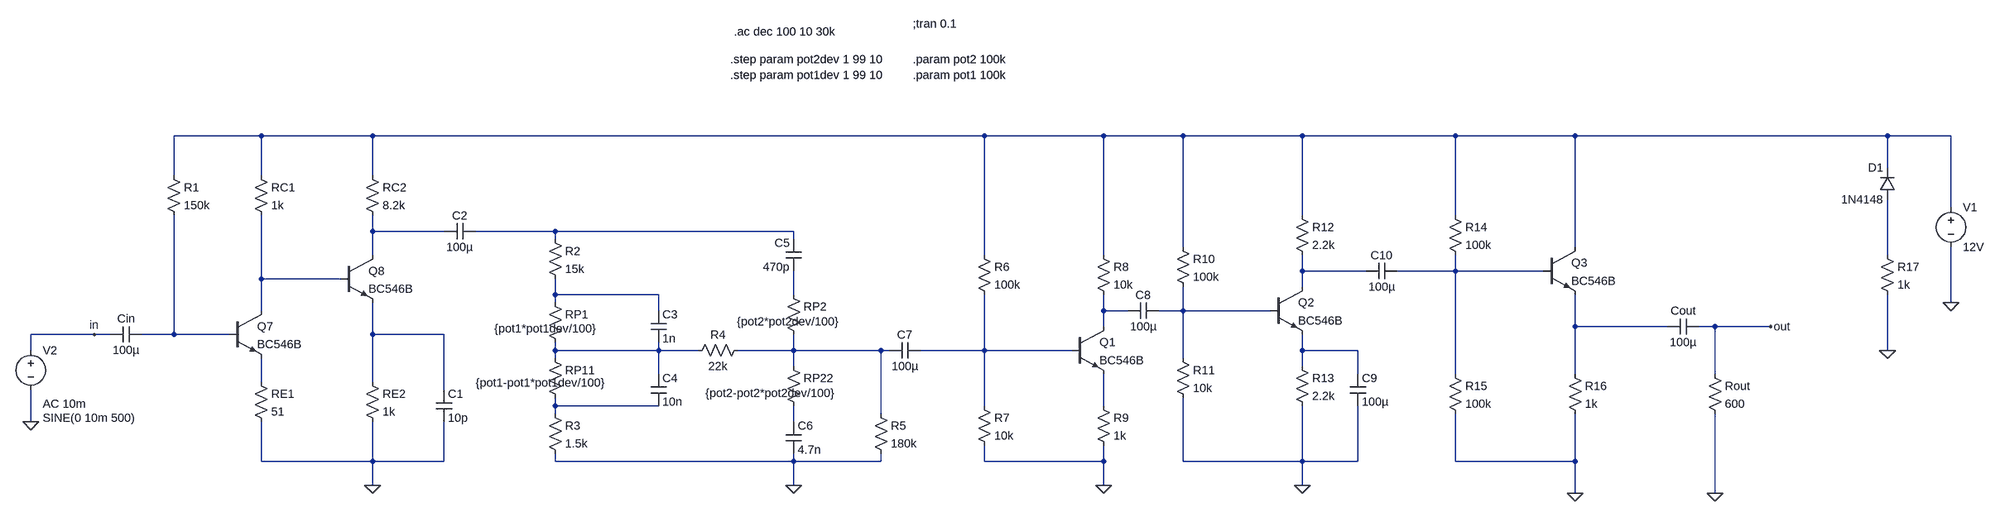
[diagram p0: schematic LTSpice project.asc]
LTSpice project.asc, the LTspice schematic file:
Version 4
SHEET 1 2792 1268
WIRE -1424 -320 -1600 -320
WIRE -1200 -320 -1424 -320
WIRE 32 -320 -1200 -320
WIRE 352 -320 32 -320
WIRE 512 -320 352 -320
WIRE 832 -320 512 -320
WIRE 1232 -320 832 -320
WIRE 1568 -320 1232 -320
WIRE 2240 -320 1568 -320
WIRE 2368 -320 2240 -320
WIRE 2240 -256 2240 -320
WIRE -1600 -240 -1600 -320
WIRE -1424 -240 -1424 -320
WIRE -1200 -240 -1200 -320
WIRE 2368 -176 2368 -320
WIRE 832 -160 832 -320
WIRE 1232 -160 1232 -320
WIRE -1200 -128 -1200 -160
WIRE -1056 -128 -1200 -128
WIRE -832 -128 -992 -128
WIRE -352 -128 -832 -128
WIRE -832 -112 -832 -128
WIRE -352 -112 -352 -128
WIRE 512 -96 512 -320
WIRE 1568 -96 1568 -320
WIRE -1200 -80 -1200 -128
WIRE 32 -80 32 -320
WIRE 352 -80 352 -320
WIRE 2240 -80 2240 -192
WIRE 832 -48 832 -80
WIRE 960 -48 832 -48
WIRE 1232 -48 1232 -80
WIRE 1232 -48 1024 -48
WIRE 1504 -48 1232 -48
WIRE -1424 -32 -1424 -160
WIRE -1264 -32 -1424 -32
WIRE 832 -16 832 -48
WIRE -832 0 -832 -32
WIRE -624 0 -832 0
WIRE -352 0 -352 -48
WIRE -832 16 -832 0
WIRE 2368 16 2368 -96
WIRE -1424 32 -1424 -32
WIRE -624 32 -624 0
WIRE 352 32 352 0
WIRE 400 32 352 32
WIRE 512 32 512 -16
WIRE 512 32 464 32
WIRE 768 32 512 32
WIRE 352 64 352 32
WIRE 1568 64 1568 0
WIRE 1792 64 1568 64
WIRE 1888 64 1856 64
WIRE 2000 64 1888 64
WIRE -1760 80 -1888 80
WIRE -1728 80 -1760 80
WIRE -1600 80 -1600 -160
WIRE -1600 80 -1664 80
WIRE -1488 80 -1600 80
WIRE -1200 80 -1200 16
WIRE -1056 80 -1200 80
WIRE -1888 112 -1888 80
WIRE -832 112 -832 96
WIRE -624 112 -624 96
WIRE -624 112 -832 112
WIRE -544 112 -624 112
WIRE -352 112 -352 80
WIRE -352 112 -464 112
WIRE -176 112 -352 112
WIRE -160 112 -176 112
WIRE 32 112 32 0
WIRE 32 112 -96 112
WIRE 288 112 32 112
WIRE 832 112 832 80
WIRE 944 112 832 112
WIRE 2240 112 2240 0
WIRE -832 128 -832 112
WIRE 512 128 512 32
WIRE -352 144 -352 112
WIRE 832 144 832 112
WIRE -624 160 -624 112
WIRE 944 160 944 112
WIRE 1232 160 1232 -48
WIRE 1568 160 1568 64
WIRE 1888 160 1888 64
WIRE -1424 176 -1424 128
WIRE -1200 176 -1200 80
WIRE -1056 192 -1056 80
WIRE -832 224 -832 208
WIRE -624 224 -832 224
WIRE 32 224 32 112
WIRE 352 224 352 160
WIRE -832 240 -832 224
WIRE -176 240 -176 112
WIRE -1888 256 -1888 192
WIRE -352 256 -352 224
WIRE -1424 336 -1424 256
WIRE -1200 336 -1200 256
WIRE -1200 336 -1424 336
WIRE -1056 336 -1056 256
WIRE -1056 336 -1200 336
WIRE -832 336 -832 320
WIRE -352 336 -352 320
WIRE -352 336 -832 336
WIRE -176 336 -176 320
WIRE -176 336 -352 336
WIRE 32 336 32 304
WIRE 352 336 352 304
WIRE 352 336 32 336
WIRE 512 336 512 208
WIRE 832 336 832 224
WIRE 832 336 512 336
WIRE 944 336 944 224
WIRE 944 336 832 336
WIRE 1232 336 1232 240
WIRE 1568 336 1568 240
WIRE 1568 336 1232 336
WIRE -1200 384 -1200 336
WIRE -352 384 -352 336
WIRE 352 384 352 336
WIRE 832 384 832 336
WIRE 1568 400 1568 336
WIRE 1888 400 1888 240
FLAG 2368 16 0
FLAG -352 384 0
FLAG -1888 256 0
FLAG 2240 112 0
FLAG -1200 384 0
FLAG -1760 80 in
FLAG 352 384 0
FLAG 832 384 0
FLAG 1568 400 0
FLAG 2000 64 out
FLAG 1888 400 0
SYMBOL cap -96 96 R90
WINDOW 0 0 32 VBottom 2
WINDOW 3 32 32 VTop 2
SYMATTR InstName C7
SYMATTR Value 100µ
SYMBOL voltage 2368 -192 R0
SYMATTR InstName V1
SYMATTR Value 12V
SYMBOL voltage -1888 96 R0
WINDOW 123 24 124 Left 2
WINDOW 39 0 0 Left 0
WINDOW 3 24 152 Left 2
SYMATTR Value2 AC 10m
SYMATTR Value SINE(0 10m 500)
SYMATTR InstName V2
SYMBOL res -848 -128 R0
SYMATTR InstName R2
SYMATTR Value 15k
SYMBOL res -848 0 R0
WINDOW 3 -107 68 Left 2
SYMATTR Value {pot1*pot1dev/100}
SYMATTR InstName RP1
SYMBOL res -848 112 R0
WINDOW 3 -144 65 Left 2
SYMATTR Value {pot1-pot1*pot1dev/100}
SYMATTR InstName RP11
SYMBOL res -848 224 R0
SYMATTR InstName R3
SYMATTR Value 1.5k
SYMBOL cap -640 32 R0
SYMATTR InstName C3
SYMATTR Value 1n
SYMBOL cap -640 160 R0
SYMATTR InstName C4
SYMATTR Value 10n
SYMBOL res -448 96 R90
WINDOW 0 0 56 VBottom 2
WINDOW 3 32 56 VTop 2
SYMATTR InstName R4
SYMATTR Value 22k
SYMBOL cap -336 -48 R180
WINDOW 0 24 56 Left 2
WINDOW 3 24 8 Left 2
SYMATTR InstName C5
SYMATTR Value 470p
SYMBOL res -368 -16 R0
WINDOW 3 -98 70 Left 2
SYMATTR Value {pot2*pot2dev/100}
SYMATTR InstName RP2
SYMBOL res -368 128 R0
WINDOW 3 -162 70 Left 2
SYMATTR Value {pot2-pot2*pot2dev/100}
SYMATTR InstName RP22
SYMBOL cap -368 256 R0
SYMATTR InstName C6
SYMATTR Value 4.7n
SYMBOL res -192 224 R0
SYMATTR InstName R5
SYMATTR Value 180k
SYMBOL res 2224 -96 R0
SYMATTR InstName R17
SYMATTR Value 1k
SYMBOL cap -992 -144 R90
WINDOW 0 0 32 VBottom 2
WINDOW 3 32 32 VTop 2
SYMATTR InstName C2
SYMATTR Value 100µ
SYMBOL cap -1664 64 R90
WINDOW 0 0 32 VBottom 2
WINDOW 3 32 32 VTop 2
SYMATTR InstName Cin
SYMATTR Value 100µ
SYMBOL res -1616 -256 R0
SYMATTR InstName R1
SYMATTR Value 150k
SYMBOL res -1440 -256 R0
SYMATTR InstName RC1
SYMATTR Value 1k
SYMBOL npn -1488 32 R0
SYMATTR InstName Q7
SYMATTR Value BC546B
SYMBOL res -1440 160 R0
SYMATTR InstName RE1
SYMATTR Value 51
SYMBOL npn -1264 -80 R0
SYMATTR InstName Q8
SYMATTR Value BC546B
SYMBOL res -1216 -256 R0
SYMATTR InstName RC2
SYMATTR Value 8.2k
SYMBOL res -1216 160 R0
SYMATTR InstName RE2
SYMATTR Value 1k
SYMBOL cap -1072 192 R0
SYMATTR InstName C1
SYMATTR Value 10p
SYMBOL diode 2256 -192 R180
WINDOW 0 24 64 Left 2
WINDOW 3 24 0 Left 2
SYMATTR InstName D1
SYMATTR Value 1N4148
SYMBOL res 336 -96 R0
SYMATTR InstName R8
SYMATTR Value 10k
SYMBOL res 336 208 R0
SYMATTR InstName R9
SYMATTR Value 1k
SYMBOL res 16 -96 R0
SYMATTR InstName R6
SYMATTR Value 100k
SYMBOL cap 464 16 R90
WINDOW 0 0 32 VBottom 2
WINDOW 3 32 32 VTop 2
SYMATTR InstName C8
SYMATTR Value 100µ
SYMBOL res 16 208 R0
SYMATTR InstName R7
SYMATTR Value 10k
SYMBOL res 816 -176 R0
SYMATTR InstName R12
SYMATTR Value 2.2k
SYMBOL res 816 128 R0
SYMATTR InstName R13
SYMATTR Value 2.2k
SYMBOL res 496 -112 R0
SYMATTR InstName R10
SYMATTR Value 100k
SYMBOL cap 1024 -64 R90
WINDOW 0 0 32 VBottom 2
WINDOW 3 32 32 VTop 2
SYMATTR InstName C10
SYMATTR Value 100µ
SYMBOL res 496 112 R0
SYMATTR InstName R11
SYMATTR Value 10k
SYMBOL cap 928 160 R0
SYMATTR InstName C9
SYMATTR Value 100µ
SYMBOL res 1552 144 R0
SYMATTR InstName R16
SYMATTR Value 1k
SYMBOL res 1216 144 R0
SYMATTR InstName R15
SYMATTR Value 100k
SYMBOL res 1216 -176 R0
SYMATTR InstName R14
SYMATTR Value 100k
SYMBOL res 1872 144 R0
SYMATTR InstName Rout
SYMATTR Value 600
SYMBOL cap 1856 48 R90
WINDOW 0 0 32 VBottom 2
WINDOW 3 32 32 VTop 2
SYMATTR InstName Cout
SYMATTR Value 100µ
SYMBOL npn 288 64 R0
SYMATTR InstName Q1
SYMATTR Value BC546B
SYMBOL npn 768 -16 R0
SYMATTR InstName Q2
SYMATTR Value BC546B
SYMBOL npn 1504 -96 R0
SYMATTR InstName Q3
SYMATTR Value BC546B
TEXT -480 -496 Left 2 !.step param pot2dev 1 99 10
TEXT -480 -464 Left 2 !.step param pot1dev 1 99 10
TEXT -112 -496 Left 2 !.param pot2 100k
TEXT -112 -464 Left 2 !.param pot1 100k
TEXT -472 -552 Left 2 !.ac dec 100 10 30k
TEXT -112 -568 Left 2 !;tran 0.1

The netlist it stands for:
* LTSpice project.asc
C7 N017 N016 100µ
V1 N001 0 12V
V2 in 0 SINE(0 10m 500) AC 10m
R2 N003 N008 15k
RP1 N008 N015 {pot1*pot1dev/100}
RP11 N015 N020 {pot1-pot1*pot1dev/100}
R3 N020 0 1.5k
C3 N008 N015 1n
C4 N015 N020 10n
R4 N016 N015 22k
C5 N009 N003 470p
RP2 N009 N016 {pot2*pot2dev/100}
RP22 N016 N022 {pot2-pot2*pot2dev/100}
C6 N022 0 4.7n
R5 N016 0 180k
R17 N004 0 1k
C2 N003 N002 100µ
Cin N013 in 100µ
R1 N001 N013 150k
RC1 N001 N007 1k
Q7 N007 N013 N019 0 BC546B
RE1 N019 0 51
Q8 N002 N007 N014 0 BC546B
RC2 N001 N002 8.2k
RE2 N014 0 1k
C1 N014 0 10p
D1 N004 N001 1N4148
R8 N001 N010 10k
R9 N021 0 1k
R6 N001 N017 100k
C8 N011 N010 100µ
R7 N017 0 10k
R12 N001 N005 2.2k
R13 N018 0 2.2k
R10 N001 N011 100k
C10 N006 N005 100µ
R11 N011 0 10k
C9 N018 0 100µ
R16 N012 0 1k
R15 N006 0 100k
R14 N001 N006 100k
Rout out 0 600
Cout out N012 100µ
Q1 N010 N017 N021 0 BC546B
Q2 N005 N011 N018 0 BC546B
Q3 N001 N006 N012 0 BC546B
.model D D
.lib standard.dio
.model NPN NPN
.model PNP PNP
.lib standard.bjt
.step param pot2dev 1 99 10
.step param pot1dev 1 99 10
.param pot2 100k
.param pot1 100k
.ac dec 100 10 30k
;tran 0.1
.backanno
.end